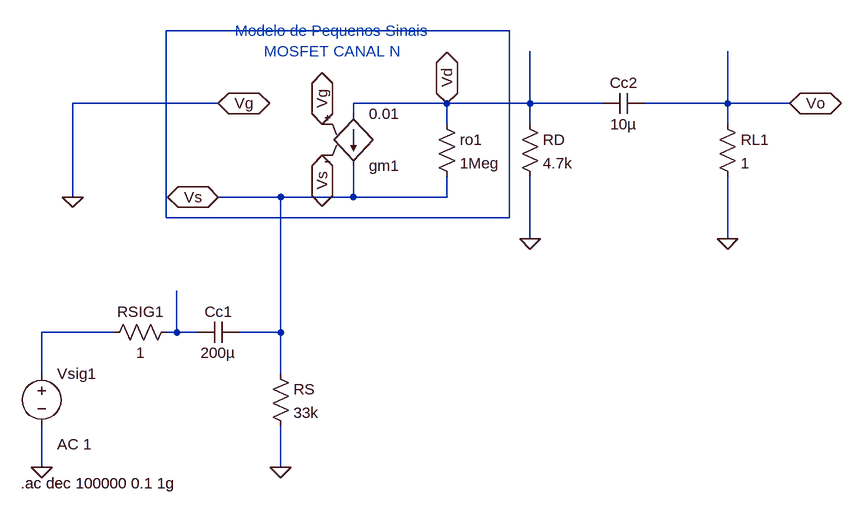
[diagram p0: schematic Porta_Comum_Baixas_Frequencias.asc]
Porta_Comum_Baixas_Frequencias.asc, the LTspice schematic file:
Version 4
SHEET 1 968 696
WIRE 448 -16 -80 -16
WIRE 0 96 -224 96
WIRE 352 96 208 96
WIRE 480 96 480 16
WIRE 480 96 352 96
WIRE 592 96 480 96
WIRE 784 96 784 16
WIRE 784 96 656 96
WIRE 880 96 784 96
WIRE 208 112 208 96
WIRE 352 128 352 96
WIRE 480 128 480 96
WIRE 784 128 784 96
WIRE -224 240 -224 96
WIRE 96 240 0 240
WIRE 208 240 208 192
WIRE 208 240 96 240
WIRE 352 240 352 208
WIRE 352 240 208 240
WIRE -80 272 -80 -16
WIRE 448 272 448 -16
WIRE 448 272 -80 272
WIRE 480 304 480 208
WIRE 784 304 784 208
WIRE -160 448 -272 448
WIRE -64 448 -64 384
WIRE -64 448 -80 448
WIRE -32 448 -64 448
WIRE 96 448 96 240
WIRE 96 448 32 448
WIRE -272 512 -272 448
WIRE 96 512 96 448
WIRE -272 656 -272 592
WIRE 96 656 96 592
FLAG -272 656 0
FLAG 160 128 Vg
IOPIN 160 128 BiDir
FLAG 160 176 Vs
IOPIN 160 176 BiDir
FLAG 0 96 Vg
IOPIN 0 96 BiDir
FLAG 0 240 Vs
IOPIN 0 240 BiDir
FLAG 480 304 0
FLAG 784 304 0
FLAG 880 96 Vo
IOPIN 880 96 BiDir
FLAG -224 240 0
FLAG 96 656 0
FLAG 352 96 Vd
IOPIN 352 96 BiDir
SYMBOL res -64 432 R90
WINDOW 0 0 56 VBottom 2
WINDOW 3 32 56 VTop 2
SYMATTR InstName RSIG1
SYMATTR Value 1
SYMBOL cap 32 432 R90
WINDOW 0 0 32 VBottom 2
WINDOW 3 32 32 VTop 2
SYMATTR InstName Cc1
SYMATTR Value 200µ
SYMBOL res 464 112 R0
SYMATTR InstName RD
SYMATTR Value 4.7k
SYMBOL res 768 112 R0
SYMATTR InstName RL1
SYMATTR Value 1
SYMBOL res 336 112 R0
SYMATTR InstName ro1
SYMATTR Value 1Meg
SYMBOL cap 656 80 R90
WINDOW 0 0 32 VBottom 2
WINDOW 3 32 32 VTop 2
SYMATTR InstName Cc2
SYMATTR Value 10µ
SYMBOL g2 208 208 M180
SYMATTR InstName gm1
SYMATTR Value 0.01
SYMBOL voltage -272 496 R0
WINDOW 123 24 124 Left 2
WINDOW 39 0 0 Left 0
SYMATTR Value2 AC 1
SYMATTR InstName Vsig1
SYMATTR Value ""
SYMBOL res 80 496 R0
SYMATTR InstName RS
SYMATTR Value 33k
TEXT 176 0 Center 2 ;Modelo de Pequenos Sinais\nMOSFET CANAL N
TEXT -304 680 Left 2 !.ac dec 100000 0.1 1g

The netlist it stands for:
* Porta_Comum_Baixas_Frequencias.asc
RSIG1 N003 N002 1
Cc1 Vs N003 200µ
RD Vd 0 4.7k
RL1 Vo 0 1
ro1 Vd Vs 1Meg
Cc2 Vo Vd 10µ
gm1 Vd Vs 0 Vs 0.01
Vsig1 N002 0 AC 1
RS Vs 0 33k
* Modelo de Pequenos Sinais
* MOSFET CANAL N
.ac dec 100000 0.1 1g
.backanno
.end